# EAGLE schematic Radii (EAGLE 9.5.1)
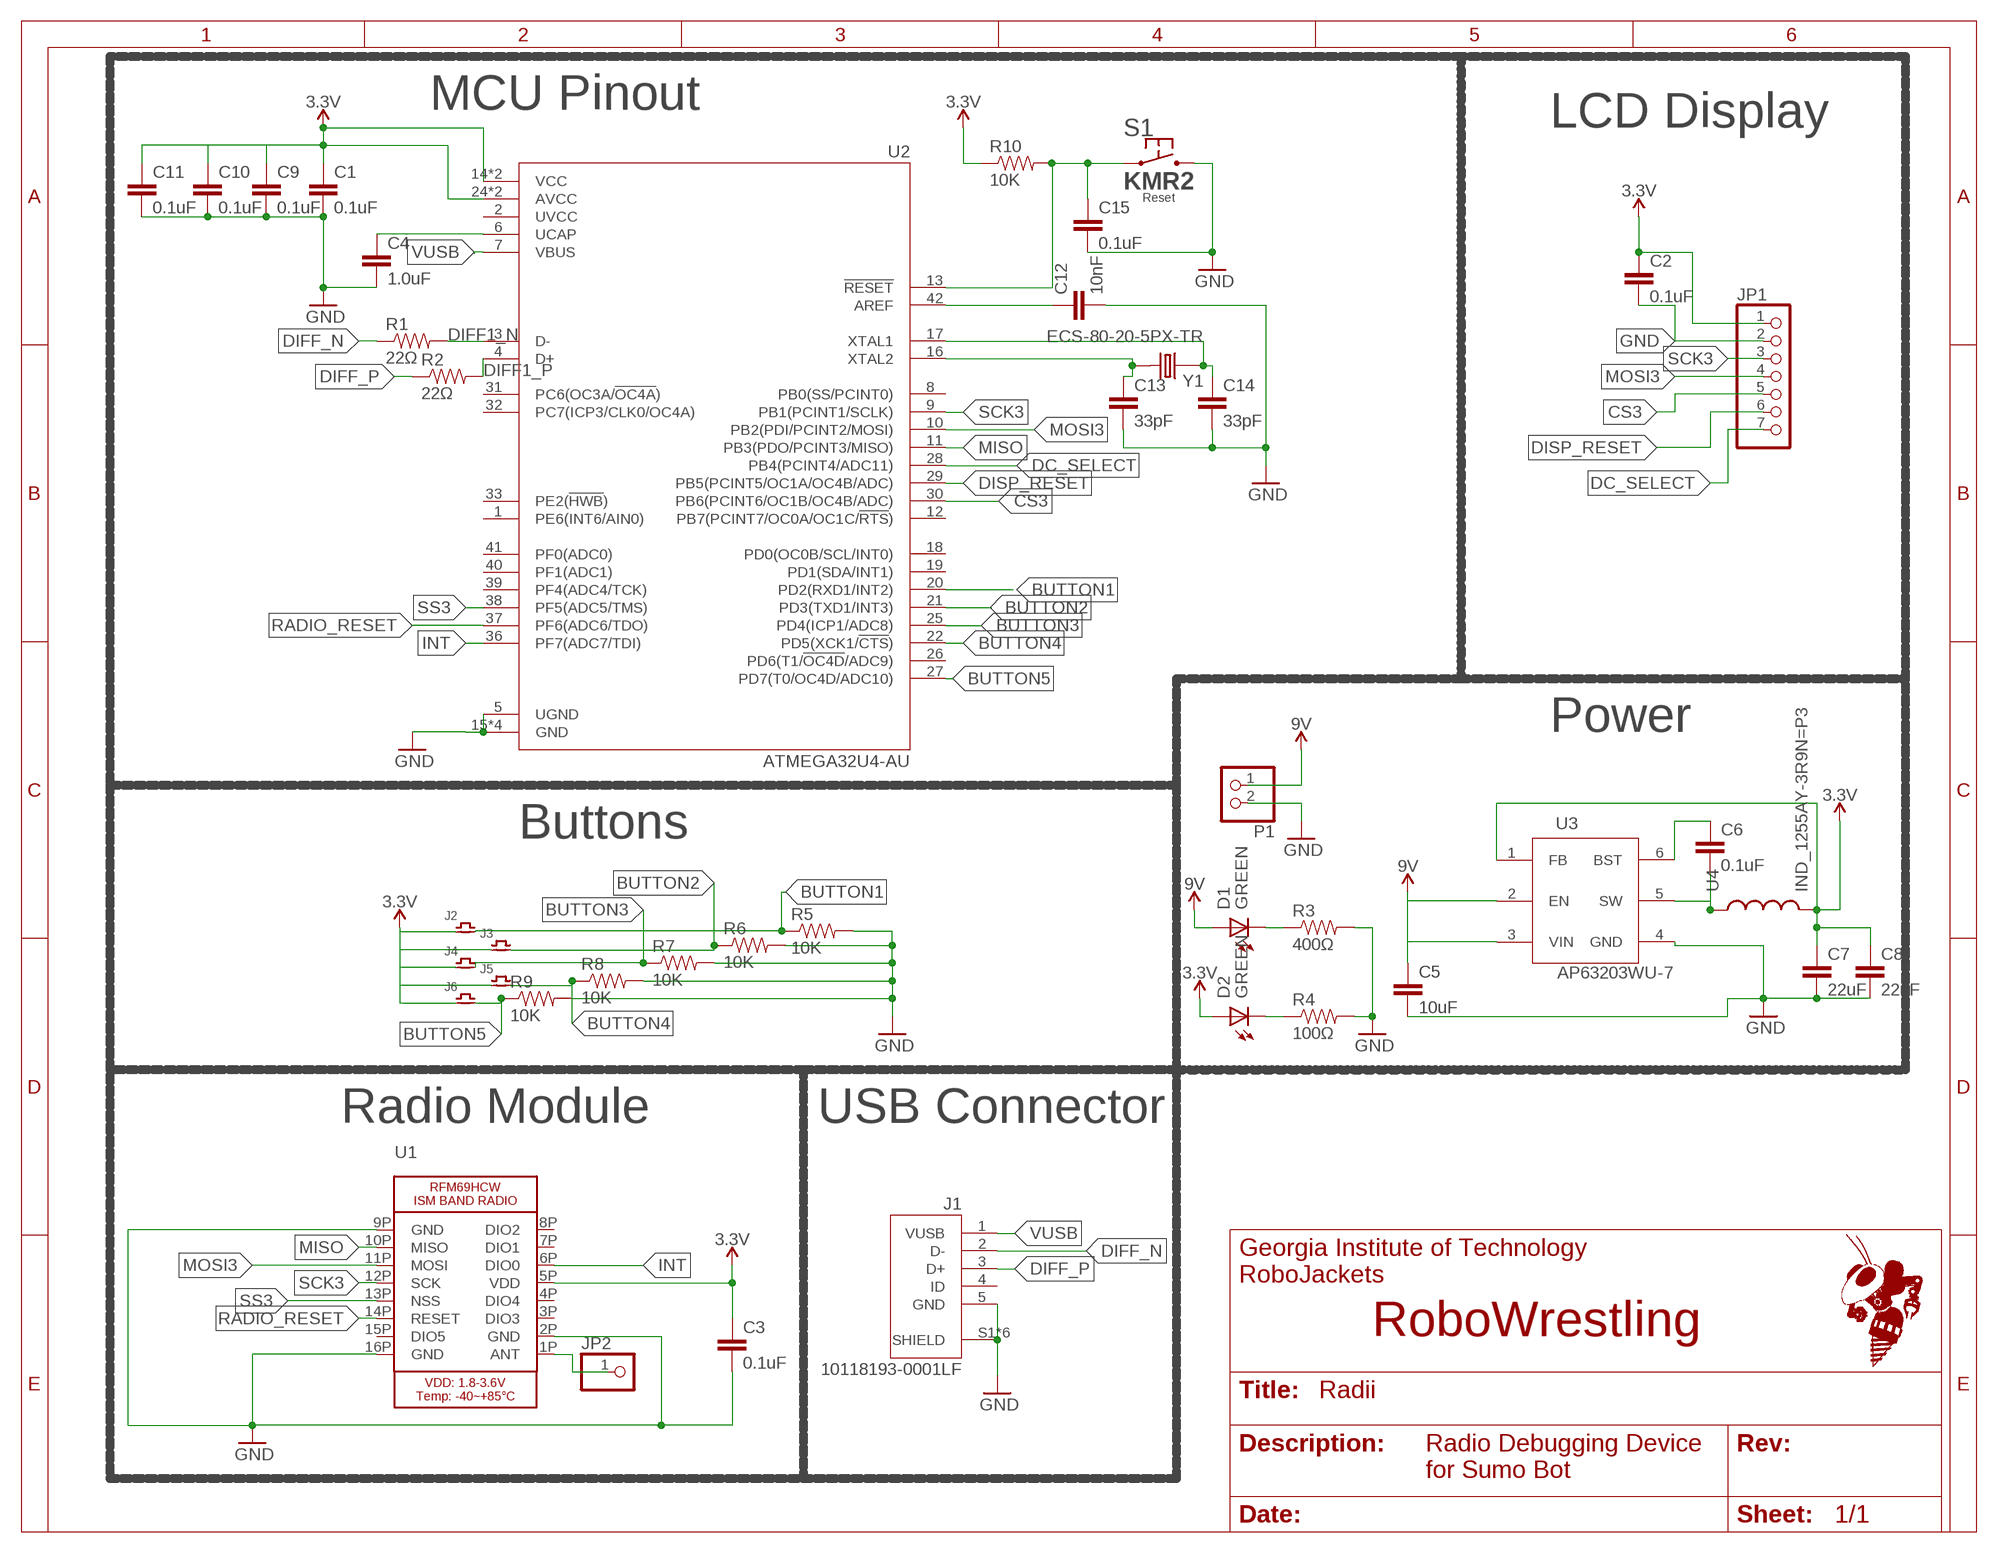
[diagram p0: schematic, sheet 1]

## Parts
C1  0.1uF  0.1UF-0603-25V-(+80/-20%)  [0603]
C2  0.1uF  0.1UF-0603-25V-(+80/-20%)  [0603]
C3  0.1uF  0.1UF-0603-25V-(+80/-20%)  [0603]
C4  1.0uF  1.0UF-0603-16V-10%  [0603]
C5  10uF  10UF-0603-6.3V-20%  [0603]
C6  0.1uF  0.1UF-0603-25V-(+80/-20%)  [0603]
C7  22uF  22UF-1210-16V-20%  [1210]
C8  22uF  22UF-1210-16V-20%  [1210]
C9  0.1uF  0.1UF-0603-25V-(+80/-20%)  [0603]
C10  0.1uF  0.1UF-0603-25V-(+80/-20%)  [0603]
C11  0.1uF  0.1UF-0603-25V-(+80/-20%)  [0603]
C12  10nF  10NF-0603-50V-10%  [0603]
C13  33pF  33PF-0603-50V-5%  [0603]
C14  33pF  33PF-0603-50V-5%  [0603]
C15  0.1uF  0.1UF-0603-25V-(+80/-20%)  [0603]
D1  GREEN  LED-SMD  [CHIP-LED0603]
D2  GREEN  LED-SMD  [CHIP-LED0603]
J1  10118193-0001LF  [FCI_10118193-0001LF]
J2  BUTTON  [1X02]
J3  BUTTON  [1X02]
J4  BUTTON  [1X02]
J5  BUTTON  [1X02]
J6  BUTTON  [1X02]
JP1  PINHD-1X7  [1X07]
JP2  PINHD-1X1  [1X01]
P1  JST_2PIN-SMT-RA  [JST-PH-2-SMT-RA]
R1  22Ω  22OHM1/10W1%(0603)  [0603-RES]
R2  22Ω  22OHM1/10W1%(0603)  [0603-RES]
R3  400Ω  RESISTOR0603  [0603-RES]
R4  100Ω  RESISTOR0603  [0603-RES]
R5  10K  10KOHM-1/10W-1%(0603)0603  [0603-RES]
R6  10K  10KOHM-1/10W-1%(0603)0603  [0603-RES]
R7  10K  10KOHM-1/10W-1%(0603)0603  [0603-RES]
R8  10K  10KOHM-1/10W-1%(0603)0603  [0603-RES]
R9  10K  10KOHM-1/10W-1%(0603)0603  [0603-RES]
R10  10K  10KOHM-1/10W-1%(0603)0603  [0603-RES]
S1  KMR2  [KMR2]
U1  RFM69HCW_SMT  [RFMHCW_SMT]
U2  ATMEGA32U4-AU  ATMEGA32U4-AUR  [QFP80P1200X1200X120-44N]
U3  AP63203WU-7  [POWERREG]
U4  IND_1255AY-3R9N=P3  [IND_1255AY-3R9N=P3]
Y1  ECS-80-20-5PX-TR  [XTAL_ECS-80-20-5PX-TR]

## Nets
3.3V: C1.1 C2.1 C3.1 C7.1 C8.1 C9.1 C10.1 C11.1 D2.A J2.1 J3.1 J4.1 J5.1 J6.1 JP1.1 R10.1 U1.5P(VDD) U2.14(VCC) U2.24(AVCC) U2.34(VCC) U2.44(AVCC) U3.1(FB) U4.2
9V: C5.1 D1.A P1.1 U3.2(EN) U3.3(VIN)
BUTTON1: J2.2 R5.1 U2.20(PD2(RXD1/INT2))
BUTTON2: J3.2 R6.1 U2.21(PD3(TXD1/INT3))
BUTTON3: J4.2 R7.1 U2.25(PD4(ICP1/ADC8))
BUTTON4: J5.2 R8.1 U2.22(PD5(XCK1/!CTS!))
BUTTON5: J6.2 R9.1 U2.27(PD7(T0/OC4D/ADC10))
CS3: JP1.5 U2.30(PB6(PCINT6/OC1B/OC4B/ADC))
DC_SELECT: JP1.7 U2.28(PB4(PCINT4/ADC11))
DIFF1_N: R1.2 U2.3(D-)
DIFF1_P: R2.2 U2.4(D+)
DIFF_N [diff]: J1.2(D-) R1.1
DIFF_P [diff]: J1.3(D+) R2.1
DISP_RESET: JP1.6 U2.29(PB5(PCINT5/OC1A/OC4B/ADC))
GND: C1.2 C2.2 C3.2 C4.2 C5.2 C7.2 C8.2 C9.2 C10.2 C11.2 C12.2 C13.2 C14.2 C15.2 J1.5(GND) J1.S1(SHIELD) J1.S2(SHIELD) J1.S3(SHIELD) J1.S4(SHIELD) J1.S5(SHIELD) J1.S6(SHIELD) JP1.2 P1.2 R3.2 R4.2 R5.2 R6.2 R7.2 R8.2 R9.2 S1.2.1 S1.2.2 U1.2P(GND) U1.9P(GND) U1.16P(GND) U2.5(UGND) U2.15(GND) U2.23(GND) U2.35(GND) U2.43(GND) U3.4(GND)
INT: U1.6P(DIO0) U2.36(PF7(ADC7/TDI))
MISO: U1.10P(MISO) U2.11(PB3(PDO/PCINT3/MISO))
MOSI3: JP1.4 U1.11P(MOSI) U2.10(PB2(PDI/PCINT2/MOSI))
N$1: C6.2 U3.5(SW) U4.1
N$2: C6.1 U3.6(BST)
N$3: JP2.1 U1.1P(ANT)
N$5: C4.1 U2.6(UCAP)
N$6: C13.1 U2.16(XTAL2) Y1.2
N$7: C12.1 U2.42(AREF)
N$8: C14.1 U2.17(XTAL1) Y1.1
N$9: D1.C(K) R3.1
N$10: D2.C(K) R4.1
N$17: C15.1 R10.2 S1.1.1 S1.1.2 U2.13(!RESET)
RADIO_RESET: U1.14P(RESET) U2.37(PF6(ADC6/TDO))
SCK3: JP1.3 U1.12P(SCK) U2.9(PB1(PCINT1/SCLK))
SS3: U1.13P(NSS) U2.38(PF5(ADC5/TMS))
VUSB: J1.1(VUSB) U2.7(VBUS)
Unconnected: J1.4(ID) U1.3P(DIO3) U1.4P(DIO4) U1.7P(DIO1) U1.8P(DIO2) U1.15P(DIO5) U2.1(PE6(INT6/AIN0)) U2.8(PB0(SS/PCINT0)) U2.12(PB7(PCINT7/OC0A/OC1C/!RTS!)) U2.18(PD0(OC0B/SCL/INT0)) U2.19(PD1(SDA/INT1)) U2.26(PD6(T1/!OC4D!/ADC9)) U2.31(PC6(OC3A/!OC4A!)) U2.32(PC7(ICP3/CLK0/OC4A)) U2.33(PE2(!HWB!)) U2.39(PF4(ADC4/TCK)) U2.40(PF1(ADC1)) U2.41(PF0(ADC0))

## Notes on the sheet
- MCU Pinout
- LCD Display
- Power
- Buttons
- Radio Module | USB Connector
- RoboWrestling
- Radio Debugging Device 
  for Sumo Bot

## Power pins joined to a net without a drawn wire
UVCC: U2.2(UVCC)

## Library data of the parts
C1-C3 C6 C9-C11 C15 = SparkFun-Capacitors:0.1UF: 0.1µF ceramic capacitors A capacitor is a passive two-terminal electrical component used to store electrical energy temporarily in an electric field.; PROD_ID: CAP-00810
C4 = SparkFun-Capacitors:1.0UF: 1µF ceramic capacitors A capacitor is a passive two-terminal electrical component used to store electrical energy temporarily in an electric field.; PROD_ID: CAP-00868
C5 = SparkFun-Capacitors:10UF: 10.0µF ceramic capacitors A capacitor is a passive two-terminal electrical component used to store electrical energy temporarily in an electric field.; PROD_ID: CAP-11015
C7 C8 = SparkFun-Capacitors:22UF: 22µF ceramic capacitors A capacitor is a passive two-terminal electrical component used to store electrical energy temporarily in an electric field.
C12 = SparkFun-Capacitors:10NF: 0.01uF/10nF/10,000pF ceramic capacitors A capacitor is a passive two-terminal electrical component used to store electrical energy temporarily in an electric field. CAP-09321; PROD_ID: CAP-00867
C13 C14 = SparkFun-Capacitors:33PF: 33pF ceramic capacitors A capacitor is a passive two-terminal electrical component used to store electrical energy temporarily in an electric field.; PROD_ID: CAP-10142
D1 D2 = RoboJackets-LEDs:LED-SMD
J1 = I'mRADIOactive:10118193-0001LF: Micro USB B Type Receptacle; DESCRIPTION: USB - micro B USB 2.0 Receptacle Connector 5 Position Surface Mount, Right Angle; Through Hole; DIGI-KEY_PART_NUMBER: 609-4616-1-ND; DIGIKEY-PURCHASE-URL: https://snapeda.com/shop?store=DigiKey&id=4800618; MF: Amphenol ICC (FCI); MP: 10118193-0001LF; PACKAGE: None
J2-J6 = I'mRADIOactive:BUTTON
JP1 = I'mRADIOactive:PINHD-1X7: PIN HEADER
JP2 = pinhead:PINHD-1X1: PIN HEADER
P1 = adafruit:JST_2PIN: JST 2-Pin Connectors of various flavors SMT-RA (S2B-PH-SM4) 4UConnector #17311 SMT (B2B-PH-SM4) THM-RA (S2B-PH) THM (B2B-PH)
R1 R2 = SparkFun-Resistors:22OHM1/10W1%(0603): RES-08698; PROD_ID: RES-08698; VALUE: 22
R3 R4 = SparkFun-Resistors:RESISTOR: Resistor Basic schematic elements and footprints for 0603, 1206, and PTH resistors.
R5-R10 = SparkFun-Resistors:10KOHM-1/10W-1%(0603): RES-00824; PROD_ID: RES-00824
S1 = RoboJackets-Switches:KMR2; FUNCTION: Reset
U1 = I'mRADIOactive:RFM69HCW: RFM69HCW - ISM Band RF Transceiver
U2 = I'mRADIOactive:ATMEGA32U4-AUR: ATmega Series 16 MHz 32 KB Flash 2.5 KB SRAM 8-Bit Microcontroller - TQFP-44; AVAILABILITY: Unavailable; DESCRIPTION: AVR AVR® ATmega Microcontroller IC 8-Bit 16MHz 32KB (16K x 16) FLASH 44-TQFP (10x10); MF: Microchip; MP: ATMEGA32U4-AUR; PACKAGE: TQFP-44 Microchip; PRICE: None
U3 = I'mRADIOactive:AP63203WU-7
U4 = I'mRADIOactive:IND_1255AY-3R9N=P3
Y1 = I'mRADIOactive:ECS-80-20-5PX-TR: CRYSTAL SMD; ARROW_AMERICAS-PURCHASE-URL: https://snapeda.com/shop?store=Arrow+Americas&id=470513; DESCRIPTION: 8MHz ±30ppm Crystal 18pF 60 Ohms HC-49/US; DIGI-KEY_PART_NUMBER: XC1271CT-ND; DIGIKEY-PURCHASE-URL: https://snapeda.com/shop?store=DigiKey&id=470513; MF: ECS Inc.; MOUSER-PURCHASE-URL: https://snapeda.com/shop?store=Mouser&id=470513; MP: ECS-80-18-5PX-TR; PACKAGE: HC49/US ECS International

## Net classes
1 diff: width 0.004 mm